# EAGLE schematic Dual H Bridge and Accessories (EAGLE 6.2)
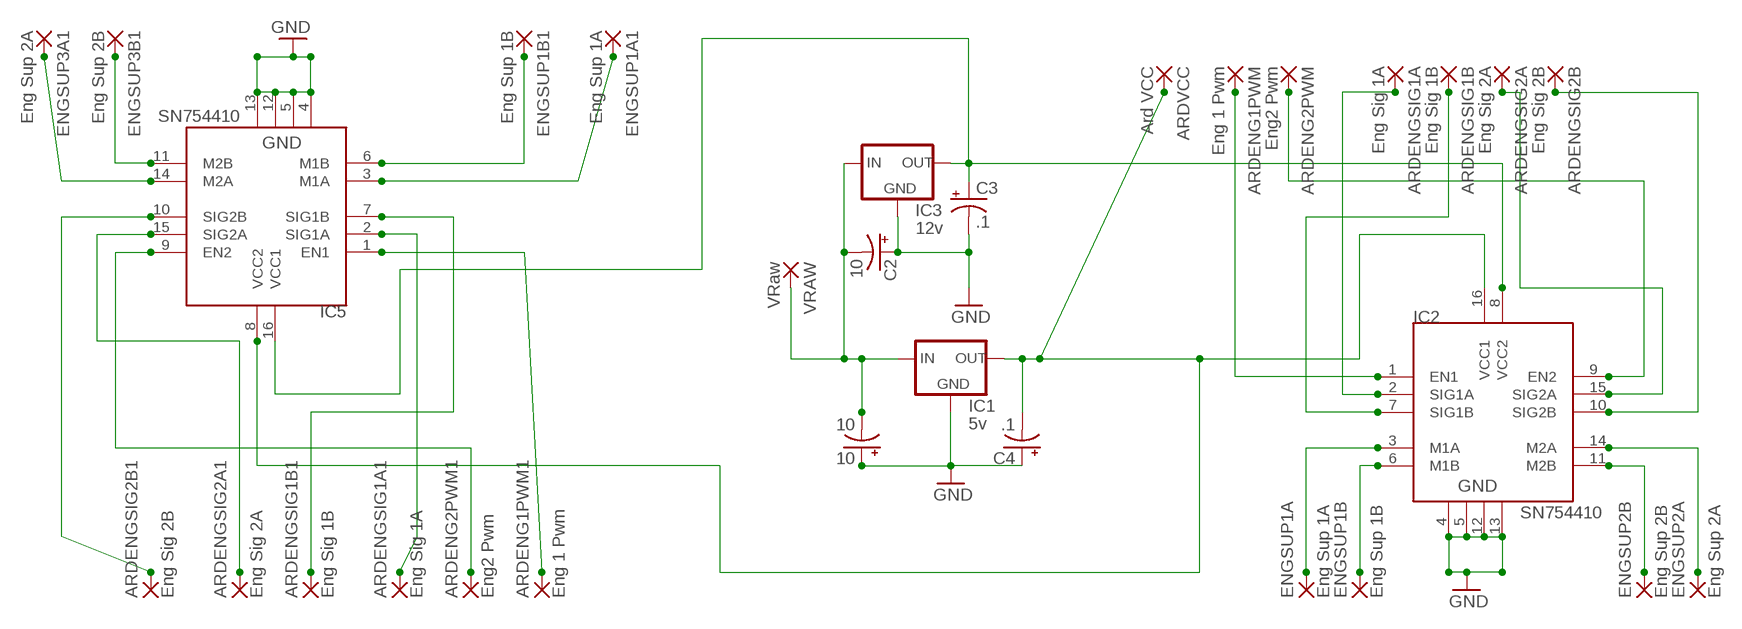
[diagram p0: schematic, sheet 1]

## Parts
10  10  CAP_POLPTH2  [CPOL-RADIAL-10UF-25V]
ARDENG1PWM  Eng 1 Pwm  3,17/1,3  [3,17/1,3]
ARDENG1PWM1  Eng 1 Pwm  3,17/1,3  [3,17/1,3]
ARDENG2PWM  Eng2 Pwm  3,17/1,3  [3,17/1,3]
ARDENG2PWM1  Eng2 Pwm  3,17/1,3  [3,17/1,3]
ARDENGSIG1A  Eng Sig 1A  3,17/1,3  [3,17/1,3]
ARDENGSIG1A1  Eng Sig 1A  3,17/1,3  [3,17/1,3]
ARDENGSIG1B  Eng Sig 1B  3,17/1,3  [3,17/1,3]
ARDENGSIG1B1  Eng Sig 1B  3,17/1,3  [3,17/1,3]
ARDENGSIG2A  Eng Sig 2A  3,17/1,3  [3,17/1,3]
ARDENGSIG2A1  Eng Sig 2A  3,17/1,3  [3,17/1,3]
ARDENGSIG2B  Eng Sig 2B  3,17/1,3  [3,17/1,3]
ARDENGSIG2B1  Eng Sig 2B  3,17/1,3  [3,17/1,3]
ARDVCC  Ard VCC  3,17/1,3  [3,17/1,3]
C2  10  CAP_POLPTH2  [CPOL-RADIAL-10UF-25V]
C3  .1  CAP_POLPTH2  [CPOL-RADIAL-10UF-25V]
C4  .1  CAP_POLPTH2  [CPOL-RADIAL-10UF-25V]
ENGSUP1A  Eng Sup 1A  3,17/1,3  [3,17/1,3]
ENGSUP1A1  Eng Sup 1A  3,17/1,3  [3,17/1,3]
ENGSUP1B  Eng Sup 1B  3,17/1,3  [3,17/1,3]
ENGSUP1B1  Eng Sup 1B  3,17/1,3  [3,17/1,3]
ENGSUP2A  Eng Sup 2A  3,17/1,3  [3,17/1,3]
ENGSUP2B  Eng Sup 2B  3,17/1,3  [3,17/1,3]
ENGSUP3A1  Eng Sup 2A  3,17/1,3  [3,17/1,3]
ENGSUP3B1  Eng Sup 2B  3,17/1,3  [3,17/1,3]
IC1  5v  78XXL  [78XXL]
IC2  SN754410  [DIP16]
IC3  12v  78XXL  [78XXL]
IC5  SN754410  [DIP16]
VRAW  VRaw  3,81/1,4  [3,81/1,4]

## Nets
ARDENGSIG1A: ARDENGSIG1A.1(P) IC2.2(SIG1A)
ARDENGSIG1A1: ARDENGSIG1A1.1(P) IC5.2(SIG1A)
ARDENGSIG1B: ARDENGSIG1B.1(P) IC2.7(SIG1B)
ARDENGSIG1B1: ARDENGSIG1B1.1(P) IC5.7(SIG1B)
ARDENGSIG2B: ARDENGSIG2B.1(P) IC2.10(SIG2B)
ARDENGSIG2B1: ARDENGSIG2B1.1(P) IC5.10(SIG2B)
GND: 10.1(+) C2.1(+) C3.2(-) C4.1(+) IC1.GND IC2.4 IC2.5 IC2.12 IC2.13 IC3.GND IC5.4 IC5.5 IC5.12 IC5.13
N$2: 10.2(-) C2.2(-) IC1.IN IC3.IN VRAW.1(P)
N$3: ARDENG1PWM.1(P) IC2.1(EN1)
N$4: ARDENG2PWM.1(P) IC2.9(EN2)
N$6: ARDENGSIG2A.1(P) IC2.15(SIG2A)
N$7: ARDENG1PWM1.1(P) IC5.1(EN1)
N$8: ENGSUP1A.1(P) IC2.3(M1A)
N$9: ENGSUP1B.1(P) IC2.6(M1B)
N$10: ENGSUP2B.1(P) IC2.11(M2B)
N$11: ENGSUP2A.1(P) IC2.14(M2A)
N$12: C3.1(+) IC2.8(VCC2) IC3.OUT IC5.16(VCC1)
N$13: ARDENG2PWM1.1(P) IC5.9(EN2)
N$14: ARDENGSIG2A1.1(P) IC5.15(SIG2A)
N$15: ENGSUP1A1.1(P) IC5.3(M1A)
N$16: ENGSUP1B1.1(P) IC5.6(M1B)
N$17: ENGSUP3B1.1(P) IC5.11(M2B)
N$18: ENGSUP3A1.1(P) IC5.14(M2A)
N$19: ARDVCC.1(P) C4.2(-) IC1.OUT IC2.16(VCC1) IC5.8(VCC2)

## Library data of the parts
10 C2-C4 = SparkFun:CAP_POL: Capacitor Polarized These are standard SMD and PTH capacitors. Normally 10uF, 47uF, and 100uF in electrolytic and tantalum varieties. Always verify the external diameter of the through hole cap, it varies with capacity, voltage, and manufacturer. The EIA devices should be standard.
ARDENG1PWM ARDENG1PWM1 ARDENG2PWM ARDENG2PWM1 ARDENGSIG1A ARDENGSIG1A1 ARDENGSIG1B ARDENGSIG1B1 ARDENGSIG2A ARDENGSIG2A1 ARDENGSIG2B ARDENGSIG2B1 ARDVCC ENGSUP1A ENGSUP1A1 ENGSUP1B ENGSUP1B1 ENGSUP2A ENGSUP2B ENGSUP3A1 ENGSUP3B1 = wirepad:3,17/1,3: THROUGH-HOLE PAD
IC1 IC3 = v-reg:78XXL: VOLTAGE REGULATOR
IC2 IC5 = HBridge:SN754410: Quadruple half-H driver
VRAW = wirepad:3,81/1,4: THROUGH-HOLE PAD